# EAGLE schematic Shield-Power-1.0-Arduino (EAGLE 7.5.0)
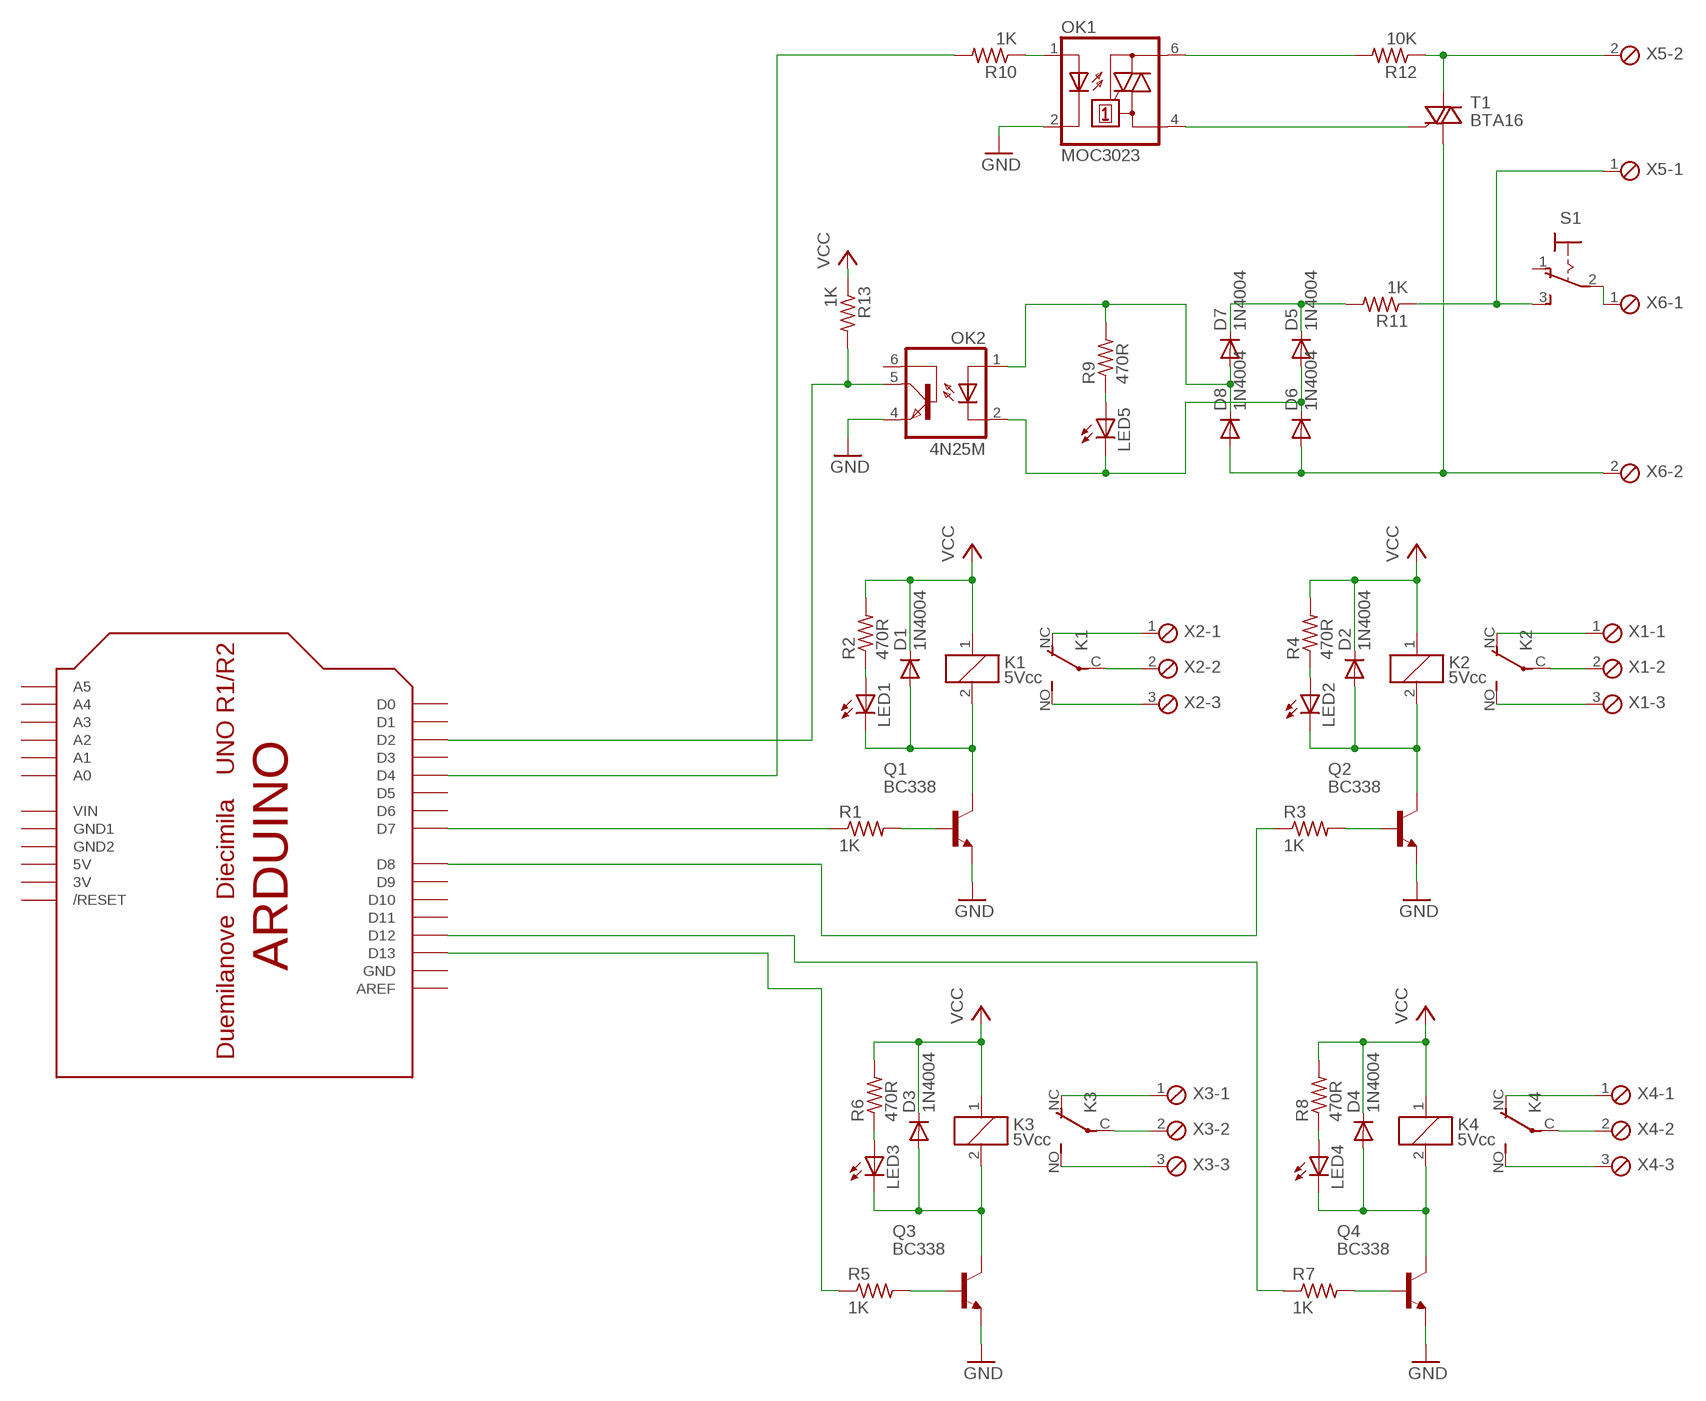
[diagram p0: schematic, sheet 1]

## Parts
D1  1N4004  [DO41-10]
D2  1N4004  [DO41-10]
D3  1N4004  [DO41-10]
D4  1N4004  [DO41-10]
D5  1N4004  [DO41-10]
D6  1N4004  [DO41-10]
D7  1N4004  [DO41-10]
D8  1N4004  [DO41-10]
K1  5Vcc  CQ1-12V  [CQ1]
K2  5Vcc  CQ1-12V  [CQ1]
K3  5Vcc  CQ1-12V  [CQ1]
K4  5Vcc  CQ1-12V  [CQ1]
LED1  LED3MM  [LED3MM]
LED2  LED3MM  [LED3MM]
LED3  LED3MM  [LED3MM]
LED4  LED3MM  [LED3MM]
LED5  LED3MM  [LED3MM]
OK1  MOC3023  MOC3031T  [DIL06B]
OK2  4N25M  [DIL06]
Q1  BC338  [TO92-EBC]
Q2  BC338  [TO92-EBC]
Q3  BC338  [TO92-EBC]
Q4  BC338  [TO92-EBC]
R1  1K  R-US_0207/10  [0207/10]
R2  470R  R-US_0207/10  [0207/10]
R3  1K  R-US_0207/10  [0207/10]
R4  470R  R-US_0207/10  [0207/10]
R5  1K  R-US_0207/10  [0207/10]
R6  470R  R-US_0207/10  [0207/10]
R7  1K  R-US_0207/10  [0207/10]
R8  470R  R-US_0207/10  [0207/10]
R9  470R  R-US_0207/10  [0207/10]
R10  1K  R-US_0207/10  [0207/10]
R11  1K  R-US_0207/10  [0207/10]
R12  10K  R-US_0207/10  [0207/10]
R13  1K  R-US_0207/10  [0207/10]
S1  320-916  [320-916]
T1  BTA16  BT138-V  [TO220BV]
U$1  ARDUINO-NOHOLE  [ARDUINO-NOHOLE]
X1  MPT3  [3POL254]
X2  MPT3  [3POL254]
X3  MPT3  [3POL254]
X4  MPT3  [3POL254]
X5  MPT2  [2POL254]
X6  MPT2  [2POL254]

## Nets
GND: OK1.2(C) OK2.4(EMI) Q1.E Q2.E Q3.E Q4.E
N$1: K2.C(2:P) X1.2
N$2: K2.NC(2:O) X1.1
N$3: K1.C(2:P) X2.2
N$4: K1.NC(2:O) X2.1
N$5: K1.NO(2:S) X2.3
N$6: K2.NO(2:S) X1.3
N$7: Q2.B R3.2
N$8: LED2.A R4.1
N$9: D2.A K2.2 LED2.K(C) Q2.C
N$10: K3.C(2:P) X3.2
N$11: K3.NC(2:O) X3.1
N$12: K3.NO(2:S) X3.3
N$13: Q1.B R1.2
N$14: LED1.A R2.1
N$15: Q3.B R5.2
N$16: D1.A K1.2 LED1.K(C) Q1.C
N$17: LED3.A R6.1
N$18: D3.A K3.2 LED3.K(C) Q3.C
N$19: K4.C(2:P) X4.2
N$20: K4.NC(2:O) X4.1
N$21: K4.NO(2:S) X4.3
N$22: Q4.B R7.2
N$23: LED4.A R8.1
N$24: D4.A K4.2 LED4.K(C) Q4.C
N$25: R1.1 U$1.D7
N$26: OK1.1(A) R10.1
N$27: R3.1 U$1.D8
N$28: R5.1 U$1.D13
N$29: R7.1 U$1.D12
N$30: OK1.6(A2) R12.2
N$31: LED5.A R9.1
N$32: D6.A D8.A T1.T1(A1) X6.2
N$33: S1.2(P) X6.1
N$34: OK1.4(A1) T1.G
N$35: R11.1 S1.3(S) X5.1
N$36: D5.C D7.C R11.2
N$38: D5.A D6.C LED5.K(C) OK2.2(C)
N$39: OK2.5(COL) R13.2 U$1.D2
N$40: R10.2 U$1.D4
N$41: R12.1 T1.T2(A2) X5.2
VCC: D1.C D2.C D3.C D4.C K1.1 K2.1 K3.1 K4.1 R2.2 R4.2 R6.2 R8.2 R13.1
VCC1: D7.A D8.C OK2.1(A) R9.2
Unconnected: OK2.6(BAS) S1.1(O) U$1.A0 U$1.A1 U$1.A2 U$1.A3 U$1.A4 U$1.A5 U$1.AREF U$1.D0 U$1.D1 U$1.D3 U$1.D5 U$1.D6 U$1.D9 U$1.D10 U$1.D11 U$1.RESET(/RESET)

## Power pins joined to a net without a drawn wire
3V: U$1.3V
5V: U$1.5V
GND: U$1.GND
GND1: U$1.GND1
GND2: U$1.GND2
VIN: U$1.VIN

## Library data of the parts
D1-D8 = diode:1N4004: DIODE general purpose rectifier, 1 A
K1-K4 = relay:CQ1-12V: AUTOMOTIVE QUIET RELAY NAiS Source: http://www.mew-europe.com/.. en_ds_61208_0000.pdf; OC_FARNELL: unknown; OC_NEWARK: unknown
LED1-LED5 = led:LED: LED OSRAM: - CHIPLED LG R971, LG N971, LY N971, LG Q971, LY Q971, LO R971, LY R971 LH N974, LH R974 LS Q976, LO Q976, LY Q976 LO Q996 - Hyper CHIPLED LW Q18S LB Q993, LB Q99A, LB R99A - SideLED LS A670, LO A670, LY A670, LG A670, LP A670 LB A673, LV A673, LT A673, LW A673 LH A674 LY A675 LS A676, LA A676, LO A676, LY A676, LW A676 LS A679, LY A679, LG A679 - Hyper Micro SIDELED® LS Y876, LA Y876, LO Y876, LY Y876 LT Y87S - SmartLED LW L88C, LW L88S LB L89C, LB L89S, LG L890 LS L89K, LO L89K, LY L89K LS L896, LA L896, LO L896, LY L896 - TOPLED LS T670, LO T670, LY T670, LG T670, LP T670 LSG T670, LSP T670, LSY T670, LOP T670, LYG T670 LG T671, LOG T671, LSG T671 LB T673, LV T673, LT T673, LW T673 LH T674 LS T676, LA T676, LO T676, LY T676, LB T676, LH T676, LSB T676, LW T676 LB T67C, LV T67C, LT T67C, LS T67K, LO T67K, LY T67K, LW E67C LS E67B, LA E67B, LO E67B, LY E67B, LB E67C, LV E67C, LT E67C LW T67C LS T679, LY T679, LG T679 LS T770, LO T770, LY T770, LG T770, LP T770 LB T773, LV T773, LT T773, LW T773 LH T774 LS E675, LA E675, LY E675, LS T675 LS T776, LA T776, LO T776, LY T776, LB T776 LHGB T686 LT T68C, LB T68C - Hyper Mini TOPLED® LB M676 - Mini TOPLED Santana® LG M470 LS M47K, LO M47K, LY M47K Source: http://www.osram.convergy.de LUXEON: - LUMILED® LXK2-PW12-R00, LXK2-PW12-S00, LXK2-PW14-U00, LXK2-PW14-V00 LXK2-PM12-R00, LXK2-PM12-S00, LXK2-PM14-U00 LXK2-PE12-Q00, LXK2-PE12-R00, LXK2-PE12-S00, LXK2-PE14-T00, LXK2-PE14-U00 LXK2-PB12-K00, LXK2-PB12-L00, LXK2-PB12-M00, LXK2-PB14-N00, LXK2-PB14-P00, LXK2-PB14-Q00 LXK2-PR12-L00, LXK2-PR12-M00, LXK2-PR14-Q00, LXK2-PR14-R00 LXK2-PD12-Q00, LXK2-PD12-R00, LXK2-PD12-S00 LXK2-PH12-R00, LXK2-PH12-S00 LXK2-PL12-P00, LXK2-PL12-Q00, LXK2-PL12-R00 Source: www.luxeon.com KINGBRIGHT: KA-3528ASYC Source: www.kingbright.com
OK1 = optocoupler:MOC30*: 6-Pin DIP Zero-Cross Optoisolators Triac Driver Output (250/400 Volt Peak) Source: Data sheet <http://www.fairchildsemi.com/ds/MO/MOC3031M.pdf> The old path of data sheet not more available 2013-05-06.; OC_FARNELL: unknown; OC_NEWARK: unknown
OK2 = optocoupler:4N*?M: General Purpose 6-Pin Phototransistor Optocouplers Source: http://www.fairchildsemi.com/ds/4N/4N35-M.pdf; MPN: 4N25-M; OC_FARNELL: 1021349; OC_NEWARK: 98K9084
Q1-Q4 = transistor-npn:BC338*: NPN Transistor
R1-R13 = rcl:R-US_: RESISTOR, American symbol
S1 = switch:320-916: TOGGLE SWITCH distributor RS Components
T1 = triac:BT138: TRIAC Source: http://www.semiconductors.philips.com BT138_SERIES_2.pdf
U$1 = GH:ARDUINO: Arduino Diecimila/Duemilanove Make a shield with ease, this package has all the named pins as well as the two mounting drill holes and an outline of the USB and DC power connector. The outline is on the DIMENSION layer, so if your board house uses it they will cut the outline to match. http://www.ladyada.net/library/pcb/eaglelibrary.html
X1-X4 = con-phoenix-254:MPT3: PHOENIX CONNECTOR; OC_FARNELL: unknown; OC_NEWARK: unknown
X5 X6 = con-phoenix-254:MPT2: PHOENIX CONNECTOR; OC_FARNELL: unknown; OC_NEWARK: unknown